# EasyEDA schematic SCH_krish's-candle.json
REV: 1.1; Date: 2024-05-21; Sheet: 1/1; Drawn By: krishnendu
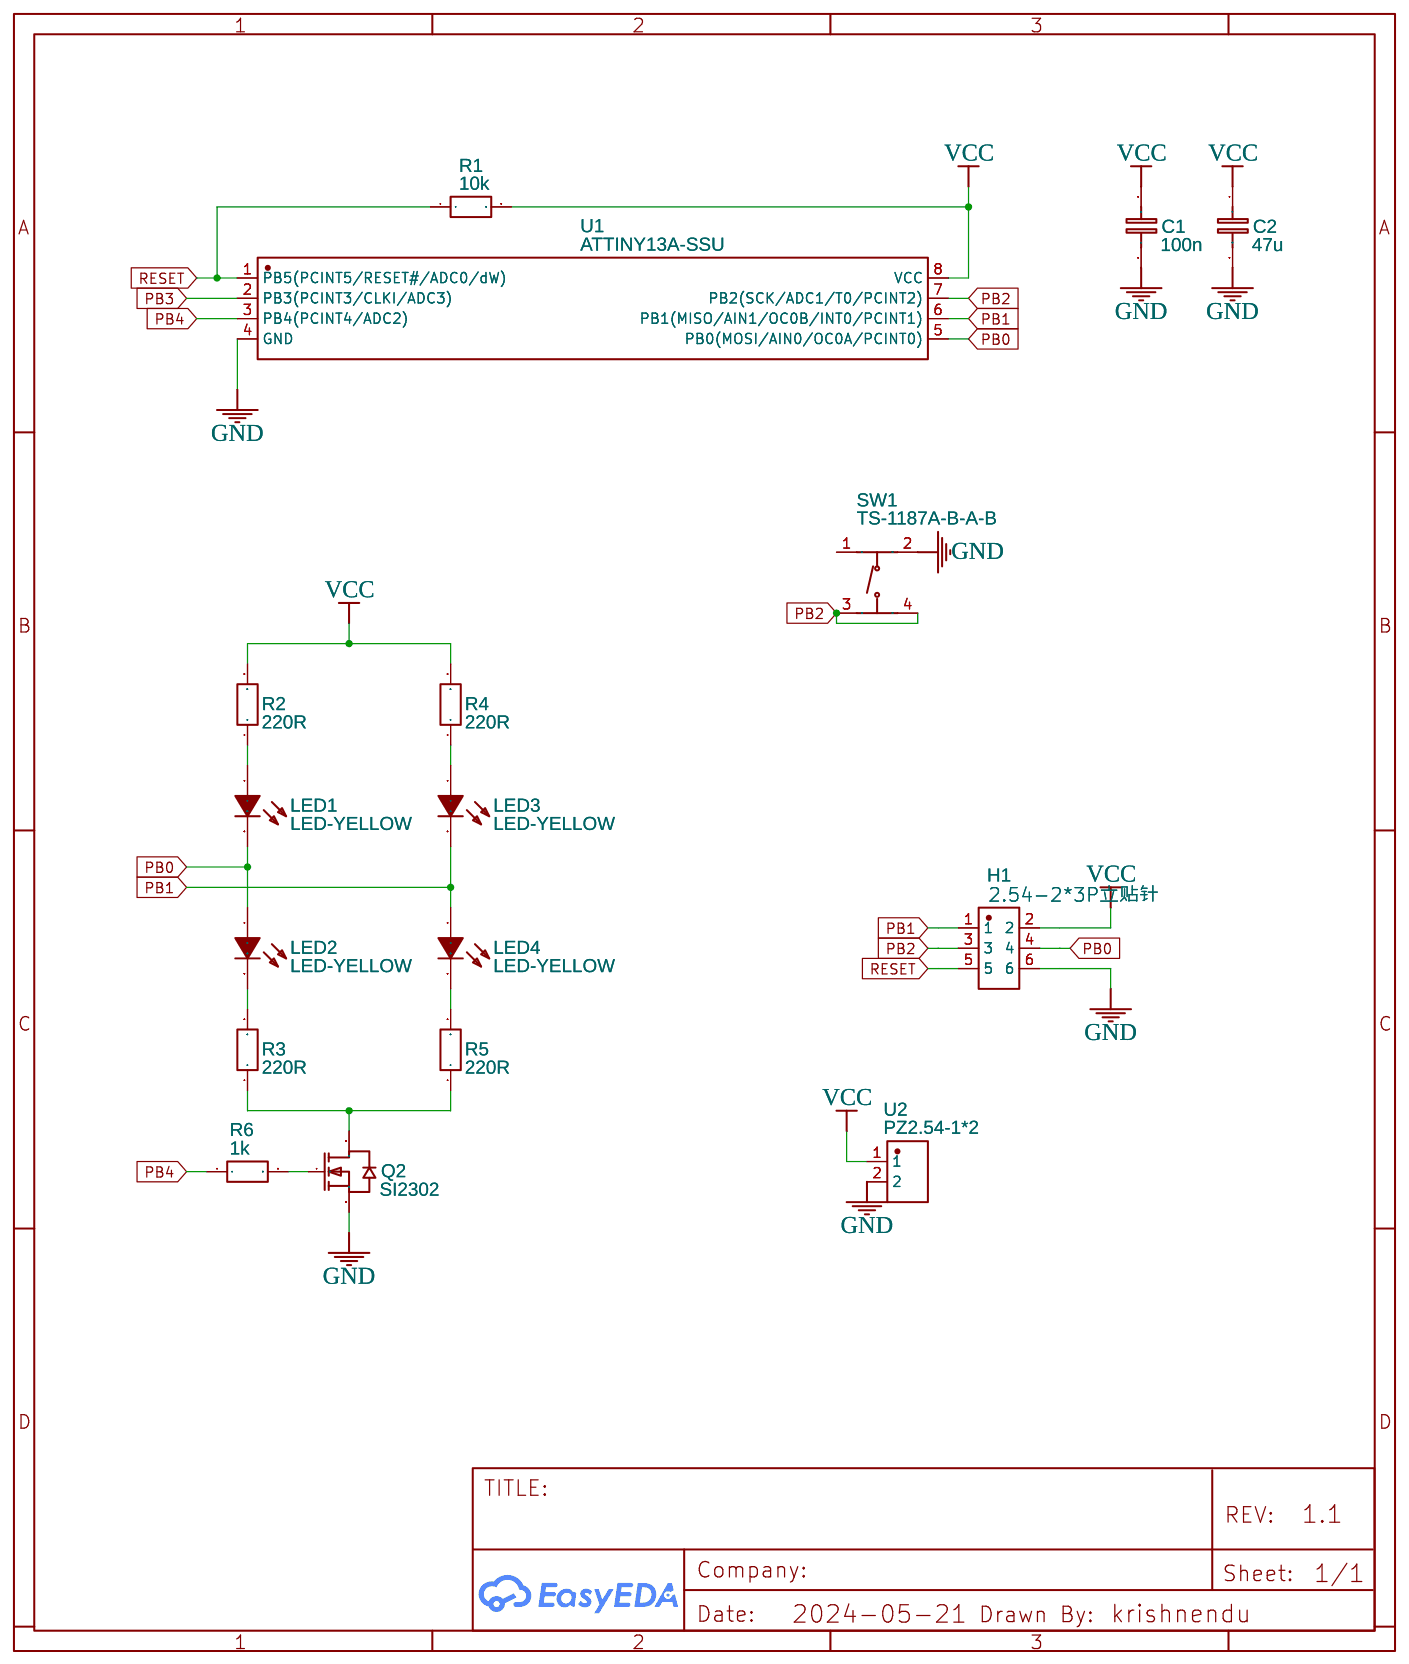
[diagram p0: schematic sheet]

## Parts
C1  100n  [0603]
C2  47u  [1206]
H1  2.54-2*3P立贴针  [HDR-SMD_6P-P2.54-V-M-R2-C5-S7.4]
LED1  LED-YELLOW  [LED-3MM/2.54]
LED2  LED-YELLOW  [LED-3MM/2.54]
LED3  LED-YELLOW  [LED-3MM/2.54]
LED4  LED-YELLOW  [LED-3MM/2.54]
Q2  SI2302  [SOT-23_L2.9-W1.3-P0.95-LS2.4-BR]
R1  10k  [0603]
R2  220R  [0603]
R3  220R  [0603]
R4  220R  [0603]
R5  220R  [0603]
R6  1k  [0603]
SW1  TS-1187A-B-A-B  [SW-SMD_4P-L5.1-W5.1-P3.70-LS6.5-TL-2]
U1  ATTINY13A-SSU  [SOP-8_150MIL]
U2  PZ2.54-1*2  [HDR-TH_2P-P2.54-V-M-3]

## Library data of the parts
C1 = Cap_0603_EU: Manufacturer Part: CC0603KRX7R9BB104; Supplier: LCSC; Manufacturer: YAGEO; Supplier Part: C14663
C2 = Cap_1206_EU: Manufacturer Part: 1206F476M160NT; Supplier: LCSC; Manufacturer: FH; Supplier Part: C30300
H1 = 2.54-2*3P立贴针: Contributor: LCSC; Supplier: LCSC; Supplier Part: C192301; Manufacturer: BOOMELE(博穆精密); JLCPCB Part Class: Extended Part
LED1-LED4 = LED-0603-YELLOW: Supplier: LCSC; Manufacturer: EVERLIGHT; Manufacturer Part: 204-10UYD/S530-A3-L; LCSC Assembly: Yes; image: //image.lceda.cn/szlcsc/C72038.jpg; Supplier Part: C85160; SMT Type: Basic; Contributor: Stefan Wagner
Q2 = SI2302_C344009: Supplier: LCSC; Supplier Part: C344009; Manufacturer: Bourne Semicon (Shenzhen); Contributor: LCSC; LCSC Assembly: Yes; SMT Type: Extend
R1 = Res_0603(1/10W)_EU: Manufacturer Part: 0603WAF1002T5E; Supplier: LCSC; Manufacturer: UniOhm; Supplier Part: C25804
R2-R5 = Res_0603(1/10W)_EU: Manufacturer Part: 0603WAF2200T5E; Supplier: LCSC; Manufacturer: UniOhm; Supplier Part: C22962
R6 = Res_0603(1/10W)_EU: Manufacturer Part: 0603WAF1001T5E; Supplier: LCSC; Manufacturer: UniOhm; Supplier Part: C21190
SW1 = TS-1187A-B-A-B: Contributor: LCSC; Supplier: LCSC; Supplier Part: C318884; Manufacturer: XKB Connectivity(中国星坤); JLCPCB Part Class: Basic Part
U1 = -: Supplier: LCSC; Manufacturer: MICROCHIP; image: //image.lceda.cn/szlcsc/C14075.jpg; Supplier Part: C14075
U2 = PZ2.54-1*2: Contributor: lcsc; Supplier: LCSC; Supplier Part: C5360898; Manufacturer: ZHOURI(洲日); JLCPCB Part Class: Extended Part

## Nets
GND: C1.2 C2.2 H1.6 Q2.2(S) SW1.2(B) U1.4(GND) U2.2
VCC: C1.1 C2.1 H1.2 R1.2 R2.2 R4.2 U1.8(VCC) U2.1
PB0: H1.4 LED1.2(C) LED2.1(A) U1.5(PB0(MOSI/AIN0/OC0A/PCINT0))
PB1: H1.1 LED3.2(C) LED4.1(A) U1.6(PB1(MISO/AIN1/OC0B/INT0/PCINT1))
PB2: H1.3 SW1.3(C) SW1.4(D) U1.7(PB2(SCK/ADC1/T0/PCINT2))
PB3: U1.2(PB3(PCINT3/CLKI/ADC3))
PB4: R6.1 U1.3(PB4(PCINT4/ADC2))
RESET: H1.5 R1.1 U1.1(PB5(PCINT5/RESET#/ADC0/dW))
Net-(LED1-1): LED1.1(A) R2.1
Net-(LED2-2): LED2.2(C) R3.2
Net-(LED3-1): LED3.1(A) R4.1
Net-(LED4-2): LED4.2(C) R5.2
Net-(Q2-1): Q2.1(G) R6.2
Net-(Q2-3): Q2.3(D) R3.1 R5.1

Not connected (* = marked no-connect by the designer): SW1 1(A)
